# Altium schematic sheet HW.SchDoc
size A4
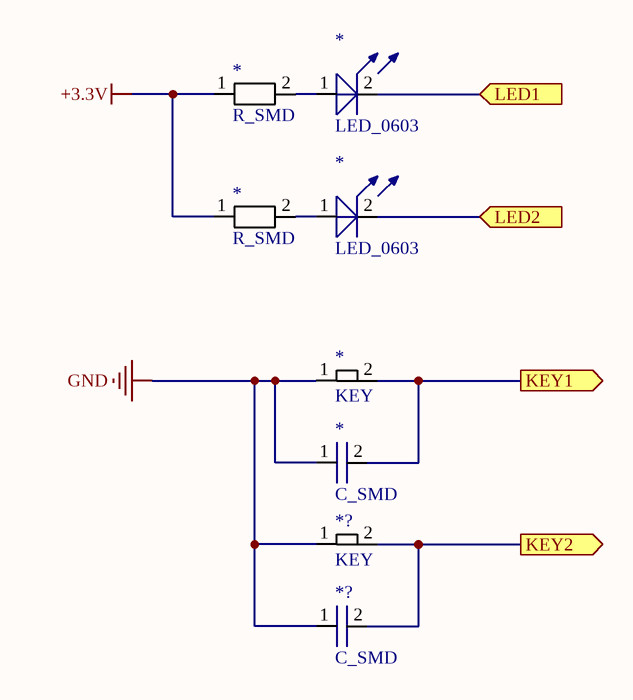
[diagram p0: HW.SchDoc]

## Parts
(Parts that share a designator on the sheet are numbered #1, #2 ... from top to bottom, then left to right.)
*#1  R_SMD  [R_SMD_0603]
*#2  LED_0603  [LED_0603_B]
*#3  R_SMD  [R_SMD_0603]
*#4  LED_0603  [LED_0603_B]
*#5  KEY  [SW_PB_3X6]
*#6  C_SMD  [C_SOP_0603]
*?#1  KEY  [SW_PB_3X6]
*?#2  C_SMD  [C_SOP_0603]

## Ports
KEY1 (out), KEY2 (out), LED1 (in), LED2 (in)

## Nets
+3.3V: *#1.1 *#3.1
GND: *#5.1 *#6.1 *?#1.1 *?#2.1
KEY1: *#5.2 *#6.2 ; port KEY1
KEY2: *?#1.2 *?#2.2 ; port KEY2
LED1: *#2.2 ; port LED1
LED2: *#4.2 ; port LED2
Net*#1_2: *#1.2 *#2.1
Net*#3_2: *#3.2 *#4.1